# EAGLE design PiHAT_v0.3 (EAGLE 7.7.0)
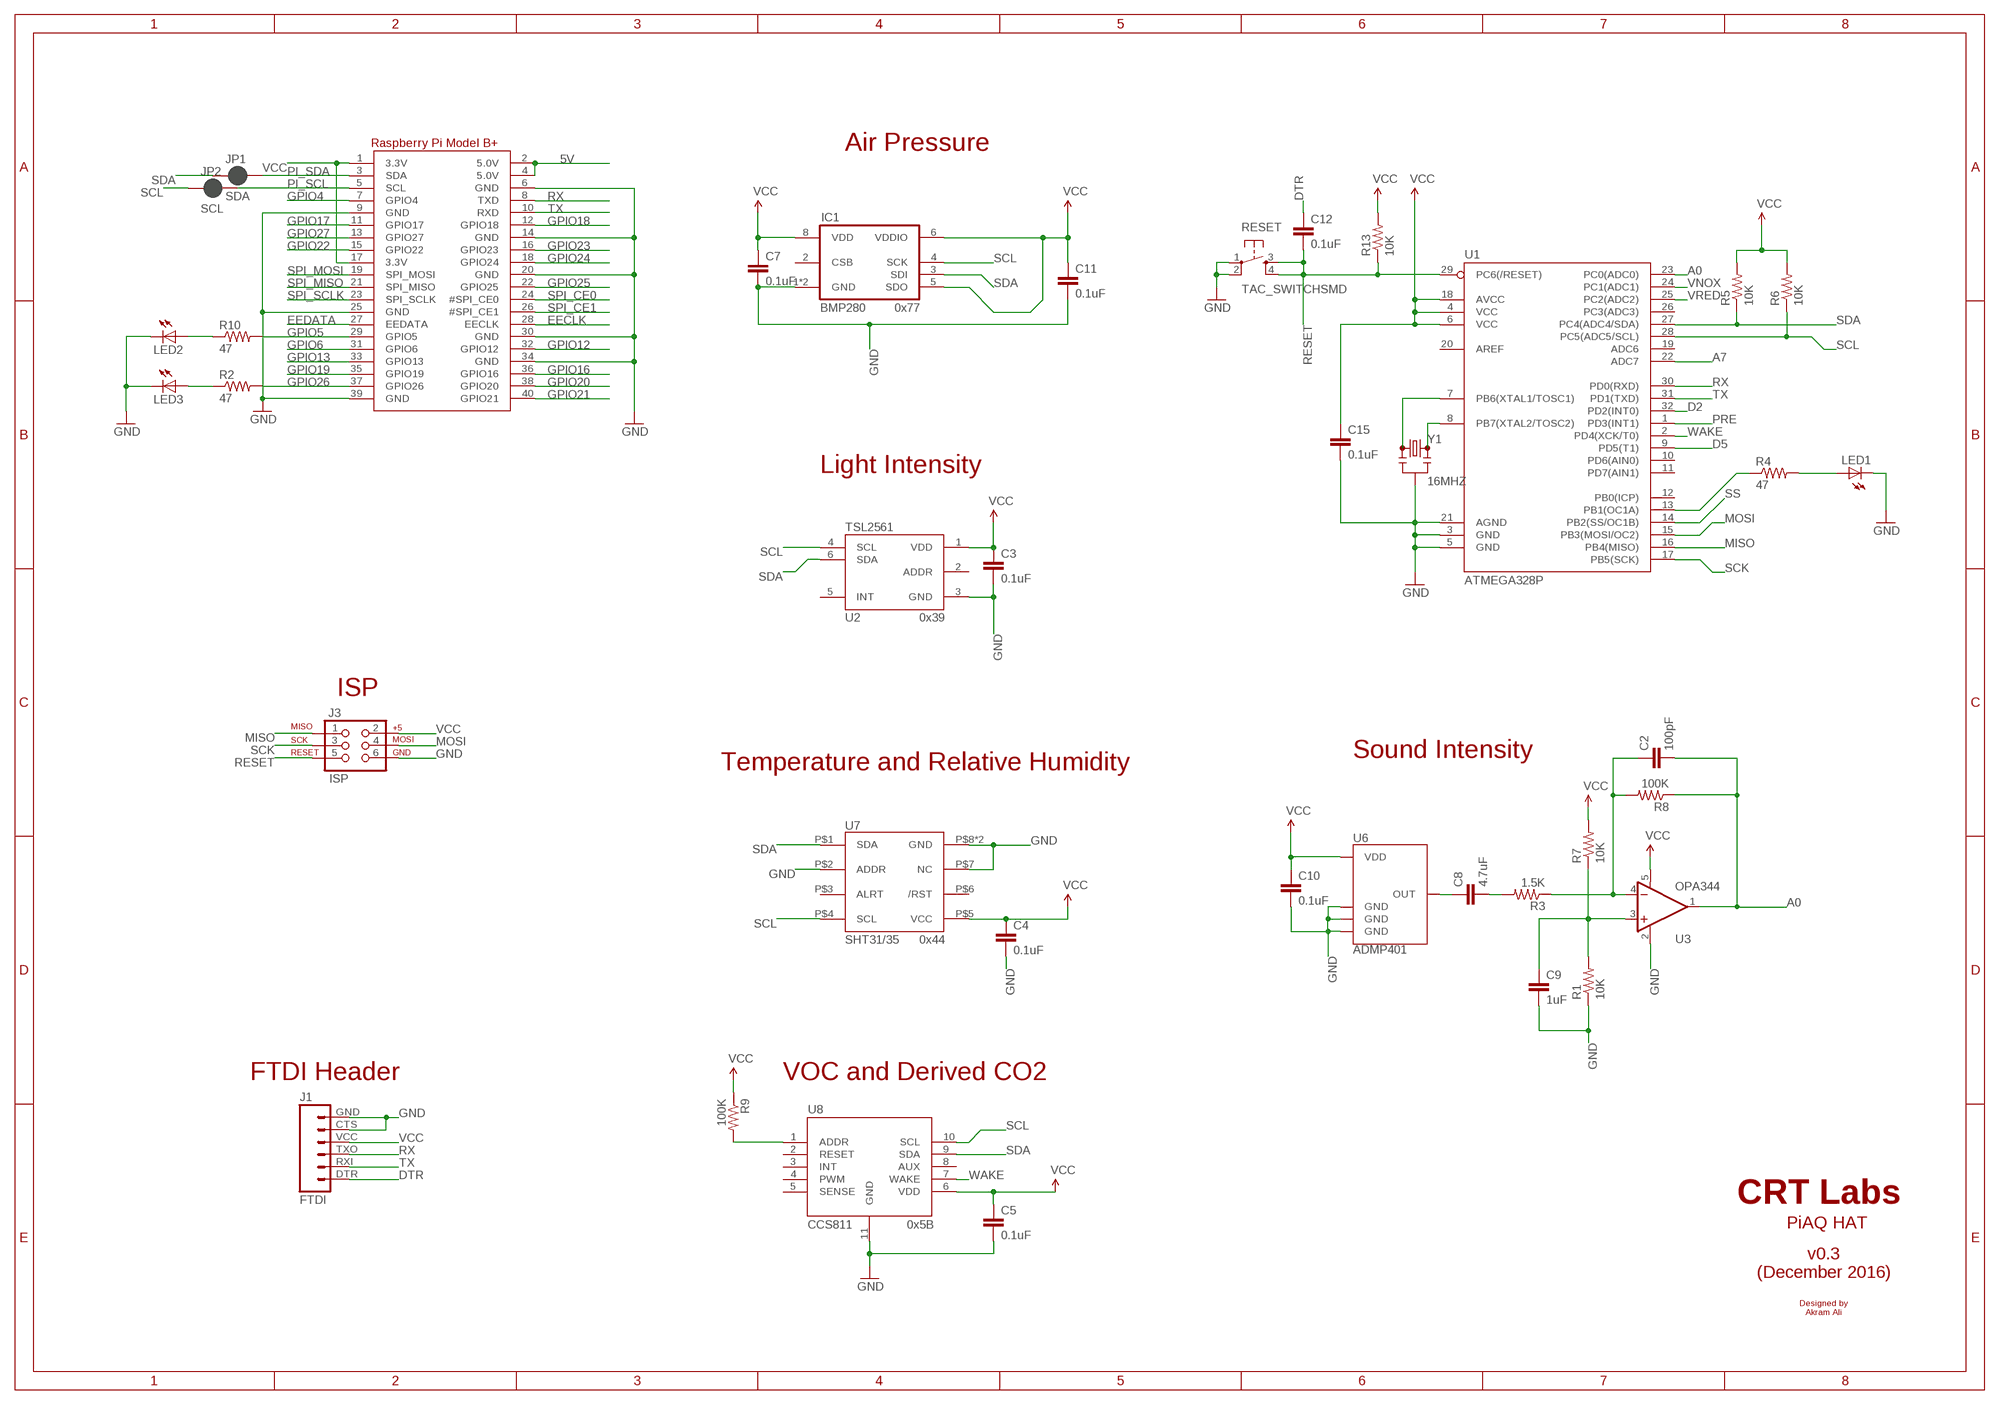
[diagram p0: schematic, sheet 1]

## Parts
C2  100pF  CAP0805  [0805]
C3  0.1uF  CAP0805  [0805]
C4  0.1uF  CAP0805  [0805]
C5  0.1uF  CAP0805  [0805]
C7  0.1uF  CAP0805  [0805]
C8  4.7uF  CAP0805  [0805]
C9  1uF  CAP0805  [0805]
C10  0.1uF  CAP0805  [0805]
C11  0.1uF  CAP0805  [0805]
C12  0.1uF  CAP0805  [0805]
C15  0.1uF  CAP0805  [0805]
IC1  BMP280  [BMP280]
J1  FTDI  FTDI_BASICPTH  [FTDI_BASIC]
J3  ISP  AVR_SPI_PRG_6PTH  [2X3]
JP1  SDA  JUMPER-PAD-2-NC_BY_PASTEFULL-BOX-SILK  [PAD-JUMPER-2-NC_BY_PASTE_YES_SILK_FULL_BOX]
JP2  SCL  JUMPER-PAD-2-NC_BY_PASTEFULL-BOX-SILK  [PAD-JUMPER-2-NC_BY_PASTE_YES_SILK_FULL_BOX]
LED1  LEDCHIPLED_0805  [CHIPLED_0805]
LED2  LEDCHIPLED_0805  [CHIPLED_0805]
LED3  LEDCHIPLED_0805  [CHIPLED_0805]
R1  10K  RESISTOR0805-RES  [0805]
R2  47  RESISTOR0805-RES  [0805]
R3  1.5K  RESISTOR0805-RES  [0805]
R4  47  RESISTOR0805-RES  [0805]
R5  10K  RESISTOR0805-RES  [0805]
R6  10K  RESISTOR0805-RES  [0805]
R7  10K  RESISTOR0805-RES  [0805]
R8  100K  RESISTOR0805-RES  [0805]
R9  100K  RESISTOR0805-RES  [0805]
R10  47  RESISTOR0805-RES  [0805]
R13  10K  RESISTOR0805-RES  [0805]
RESET  TAC_SWITCHSMD  [TACTILE-SWITCH-SMD]
RPI1  RASPBERRYPI_BPLUS_HATSLOTS  [PI_HAT_SLOTS]
U1  ATMEGA328P  ATMEGA328P_TQFP  [TQFP32-08]
U2  TSL2561  TSL2561FN  [FN-6]
U3  OPA344  [SOT23-5]
U6  ADMP401  [ADMP401]
U7  SHT31/35  SHT31-DIS  [SHT3X]
U8  CCS811  CCS811-I2C  [LGA]
Y1  16MHZ  RESONATOR16MHZ  [RESONATOR-SMD]

## Nets
5V: RPI1.2(5.0V) RPI1.4(5.0V)
A0: C2.2 R8.1 U1.23(PC0(ADC0)) U3.1(OUT)
A7: U1.22(ADC7)
D2: U1.32(PD2(INT0))
D5: U1.9(PD5(T1))
DTR: C12.1 J1.DTR
EECLK: RPI1.28(EECLK)
EEDATA: RPI1.27(EEDATA)
GND: C3.2 C4.2 C5.2 C7.2 C9.2 C10.2 C11.2 C15.2 IC1.1(GND) IC1.7(GND) J1.CTS J1.GND J3.6 LED1.C LED2.C LED3.C R1.1 RESET.1 RESET.2 RPI1.6(GND) RPI1.9(GND) RPI1.14(GND) RPI1.20(GND) RPI1.25(GND) RPI1.30(GND) RPI1.34(GND) RPI1.39(GND) U1.3(GND) U1.5(GND) U1.21(AGND) U2.3(GND) U3.2(V-) U6.2(GND) U6.4(GND) U6.6(GND) U7.P$2(ADDR) U7.P$7(NC) U7.P$8(GND) U7.PAD(GND) U8.11(GND) Y1.2
GPIO4: RPI1.7(GPIO4)
GPIO5: R10.2 RPI1.29(GPIO5)
GPIO6: RPI1.31(GPIO6)
GPIO12: RPI1.32(GPIO12)
GPIO13: RPI1.33(GPIO13)
GPIO16: RPI1.36(GPIO16)
GPIO17: RPI1.11(GPIO17)
GPIO18: RPI1.12(GPIO18)
GPIO19: RPI1.35(GPIO19)
GPIO20: RPI1.38(GPIO20)
GPIO21: RPI1.40(GPIO21)
GPIO22: RPI1.15(GPIO22)
GPIO23: RPI1.16(GPIO23)
GPIO24: RPI1.18(GPIO24)
GPIO25: RPI1.22(GPIO25)
GPIO26: R2.2 RPI1.37(GPIO26)
GPIO27: RPI1.13(GPIO27)
MISO: J3.1 U1.16(PB4(MISO))
MOSI: J3.4 U1.15(PB3(MOSI/OC2))
N$1: LED3.A R2.1
N$2: R4.1 U1.13(PB1(OC1A))
N$3: LED1.A R4.2
N$4: U1.8(PB7(XTAL2/TOSC2)) Y1.3
N$5: U1.7(PB6(XTAL1/TOSC1)) Y1.1
N$6: LED2.A R10.1
N$7: C8.1 U6.1(OUT)
N$9: C8.2 R3.2
N$10: C2.1 R3.1 R8.2 U3.4(-IN)
N$11: C9.1 R1.2 R7.1 U3.3(+IN)
N$16: R9.2 U8.1(ADDR)
PI_SCL: JP2.2 RPI1.5(SCL)
PI_SDA: JP1.2 RPI1.3(SDA)
PRE: U1.1(PD3(INT1))
RESET: C12.2 J3.5 R13.1 RESET.3 RESET.4 U1.29(PC6(/RESET))
RX: J1.TXO RPI1.8(TXD) U1.30(PD0(RXD))
SCK: J3.3 U1.17(PB5(SCK))
SCL: IC1.4(SCK) JP2.1 R6.1 U1.28(PC5(ADC5/SCL)) U2.4(SCL) U7.P$4(SCL) U8.10(SCL)
SDA: IC1.3(SDI) JP1.1 R5.1 U1.27(PC4(ADC4/SDA)) U2.6(SDA) U7.P$1(SDA) U8.9(SDA)
SPI_CE0: RPI1.24(#SPI_CE0)
SPI_CE1: RPI1.26(#SPI_CE1)
SPI_MISO: RPI1.21(SPI_MISO)
SPI_MOSI: RPI1.19(SPI_MOSI)
SPI_SCLK: RPI1.23(SPI_SCLK)
SS: U1.14(PB2(SS/OC1B))
TX: J1.RXI RPI1.10(RXD) U1.31(PD1(TXD))
VCC: C3.1 C4.1 C5.1 C7.1 C10.1 C11.1 C15.1 IC1.5(SDO) IC1.6(VDDIO) IC1.8(VDD) J1.VCC J3.2 R5.2 R6.2 R7.2 R9.1 R13.2 RPI1.1(3.3V) RPI1.17(3.3V) U1.4(VCC) U1.6(VCC) U1.18(AVCC) U2.1(VDD) U3.5(V+) U6.5(VDD) U7.P$5(VCC) U8.6(VDD)
VNOX: U1.24(PC1(ADC1))
VRED: U1.25(PC2(ADC2))
WAKE: U1.2(PD4(XCK/T0)) U8.7(WAKE)
Unconnected: IC1.2(CSB) U1.10(PD6(AIN0)) U1.11(PD7(AIN1)) U1.12(PB0(ICP)) U1.19(ADC6) U1.20(AREF) U1.26(PC3(ADC3)) U2.2(ADDR) U2.5(INT) U7.P$3(ALRT) U7.P$6(/RST) U8.2(RESET) U8.3(INT) U8.4(PWM) U8.5(SENSE) U8.8(AUX)

## Notes on the sheet
- Air Pressure
- 0x77
- Light Intensity
- 0x39
- ISP
- Sound Intensity
- Temperature and Relative Humidity
- 0x44
- FTDI Header | VOC and Derived CO2
- CRT Labs
- 0x5B | PiAQ HAT
- v0.3
  (December 2016)
- Designed by
  Akram Ali

## Library data of the parts
C2 = SparkFun-Capacitors:CAP: Capacitor Standard 0603 ceramic capacitor, and 0.1" leaded capacitor.; MPN: CC0805JRNPO9BN101
C3-C5 C7 C11 C12 C15 = SparkFun-Passives:CAP: Capacitor Standard 0603 ceramic capacitor, and 0.1" leaded capacitor.; MPN: CC0603KRX7R7BB104
C8 = SparkFun-Capacitors:CAP: Capacitor Standard 0603 ceramic capacitor, and 0.1" leaded capacitor.; MPN: CC0805KKX5R8BB475
C9 = SparkFun-Capacitors:CAP: Capacitor Standard 0603 ceramic capacitor, and 0.1" leaded capacitor.; MPN: CC0805KKX7R7BB105
C10 = SparkFun-Capacitors:CAP: Capacitor Standard 0603 ceramic capacitor, and 0.1" leaded capacitor.; MPN: CC0603KRX7R7BB104
IC1 = bosch-bmp280:BMP280: The BMP280 is an absolute barometric pressure sensor especially designed for mobile applications. The sensor module is housed in an extremely compact 8-pin metal-lid LGA package with a footprint of only 2.0 × 2.5 mm2 and 0.95 mm package height. Its small dimensions and its low power consumption of 2.7 μA @1Hz allow the implementation in battery driven devices such as mobile phones, GPS modules or watches. The library has been designed by Richard Magdycz <https://www.facebook.com/groups/eaglecadsoftUK>; MPN: BMP280
J1 = SparkFun-Connectors:FTDI_BASIC: FTDI Basic header with labels; NO_BOM: TRUE
J3 = SparkFun-Connectors:AVR_SPI_PRG_6: AVR ISP 6 Pin This is the reduced ISP connector for AVR programming. Common on Arduino. This footprint will take up less PCB space and can be used with a 10-pin to 6-pin adapter such as SKU: BOB-08508 **Special note about "TEST_POINT" package. The stop mask is on the top side, so if you want your programming test points to be on the bottom of your board, make sure to place this package on the bottom side of the board. This also ensure that the orientation to program from the bottom side will be correct.; NO_BOM: TRUE
JP1 JP2 = SparkFun-Passives:JUMPER-PAD-2-NC_BY_PASTE; NO_BOM: TRUE
LED1-LED3 = adafruit:LED: LED OSRAM: - CHIPLED LG R971, LG N971, LY N971, LG Q971, LY Q971, LO R971, LY R971 LH N974, LH R974 LS Q976, LO Q976, LY Q976 LO Q996 - Hyper CHIPLED LW Q18S LB Q993, LB Q99A, LB R99A - SideLED LS A670, LO A670, LY A670, LG A670, LP A670 LB A673, LV A673, LT A673, LW A673 LH A674 LY A675 LS A676, LA A676, LO A676, LY A676, LW A676 LS A679, LY A679, LG A679 - Hyper Micro SIDELED® LS Y876, LA Y876, LO Y876, LY Y876 LT Y87S - SmartLED LW L88C, LW L88S LB L89C, LB L89S, LG L890 LS L89K, LO L89K, LY L89K LS L896, LA L896, LO L896, LY L896 - TOPLED LS T670, LO T670, LY T670, LG T670, LP T670 LSG T670, LSP T670, LSY T670, LOP T670, LYG T670 LG T671, LOG T671, LSG T671 LB T673, LV T673, LT T673, LW T673 LH T674 LS T676, LA T676, LO T676, LY T676, LB T676, LH T676, LSB T676, LW T676 LB T67C, LV T67C, LT T67C, LS T67K, LO T67K, LY T67K, LW E67C LS E67B, LA E67B, LO E67B, LY E67B, LB E67C, LV E67C, LT E67C LW T67C LS T679, LY T679, LG T679 LS T770, LO T770, LY T770, LG T770, LP T770 LB T773, LV T773, LT T773, LW T773 LH T774 LS E675, LA E675, LY E675, LS T675 LS T776, LA T776, LO T776, LY T776, LB T776 LHGB T686 LT T68C, LB T68C - Hyper Mini TOPLED® LB M676 - Mini TOPLED Santana® LG M470 LS M47K, LO M47K, LY M47K Source: http://www.osram.convergy.de/; MPN: LTST-C170TBKT
R1 R7 R13 = SparkFun-Passives:RESISTOR: Resistor Basic schematic elements and footprints for 0603, 1206, and PTH resistors.; MPN: RC0805JR-0710KL
R2 R4 R10 = SparkFun-Resistors:RESISTOR: Resistor Basic schematic elements and footprints for 0603, 1206, and PTH resistors.; MPN: RC0805JR-0747RL
R3 = SparkFun-Passives:RESISTOR: Resistor Basic schematic elements and footprints for 0603, 1206, and PTH resistors.; MPN: RT0805BRD071K5L
R5 R6 = SparkFun-Resistors:RESISTOR: Resistor Basic schematic elements and footprints for 0603, 1206, and PTH resistors.; MPN: RC0805JR-0710KL
R8 R9 = SparkFun-Passives:RESISTOR: Resistor Basic schematic elements and footprints for 0603, 1206, and PTH resistors.; MPN: RC0805FR-07100KL
RESET = SparkFun-Retired:TAC_SWITCH: Momentary Switch Button commonly used for reset or general input. Spark Fun Electronics SKU : COM-00097 SMT- SWCH-08247; MPN: PTS525SM15SMTR2 LFS; PROD_ID: SWCH-08247
RPI1 = microbuilder:RASPBERRYPI_BPLUS; NO_BOM: TRUE
U1 = SparkFun-DigitalIC:ATMEGA328P_TQFP; MPN: ATMEGA328PB-AU; PROD_ID: IC-09069; VALUE: ATMEGA328P_TQFP
U2 = SparkFun-DigitalIC:TSL2561: TSL2561 illumination sensor Approximates Human Eye Response Precisely Measures Illuminance Programmable Interrupt Function with User-Defined Upper and Lower Threshold 400 KHz I2C interface Programmable Analog Gain and Integration Time Supporting 1,000,000-to-1 Dynamic Range Automatically Rejects 50/60-Hz Lighting Ripple Low Active Power (0.75 mW Typical) with Power Down Mode RoHS Compliant The TSL2561 is a light-to-digital converter that transform light intensity to a digital signal output via I2C interface. The device combines one broadband photodiode (visible plus infrared) and one infrared-responding photodiode on a single CMOS integrated circuit capable of providing a near-photopic response over an effective 20-bit dynamic range (16-bit resolution). Two integrating ADCs convert the photodiode currents to a digital output that represents the irradiance measured on each channel. This digital output can be input to a microprocessor where illuminance (ambient light level) in lux is derived using an empirical formula to approximate the human eye response. The TSL2561 device supports a traditional level style interrupt that remains asserted until the firmware clears it.; MPN: TSL2561FN; PROD_ID: IC-11791
U3 = SparkFun-AnalogIC:OPA344: Single gate rail-to-rail output op-amp. Inputs extend 300mV past rails.; MPN: OPA344NA/3K; PROD_ID: IC-08251
U6 = SparkFun-Sensors:ADMP401: Omnidirection bottom-port MEMS microphone; MPN: INMP401ACEZ-R7
U7 = thomasb9511:SHT31-DIS; MPN: SHT31-DIS-B
U8 = CCS811:CCS811; MPN: CCS811
Y1 = SparkFun-FreqCtrl:RESONATOR: Resonator Small SMD resonator. Used, eg, on the Arduino Pro/ Pro Mini boards. 8MHz- XTAL-08895 16MHz- XTAL-08900; MPN: CSTCE16M0V53-R0; PROD_ID: XTAL-08900

## Board
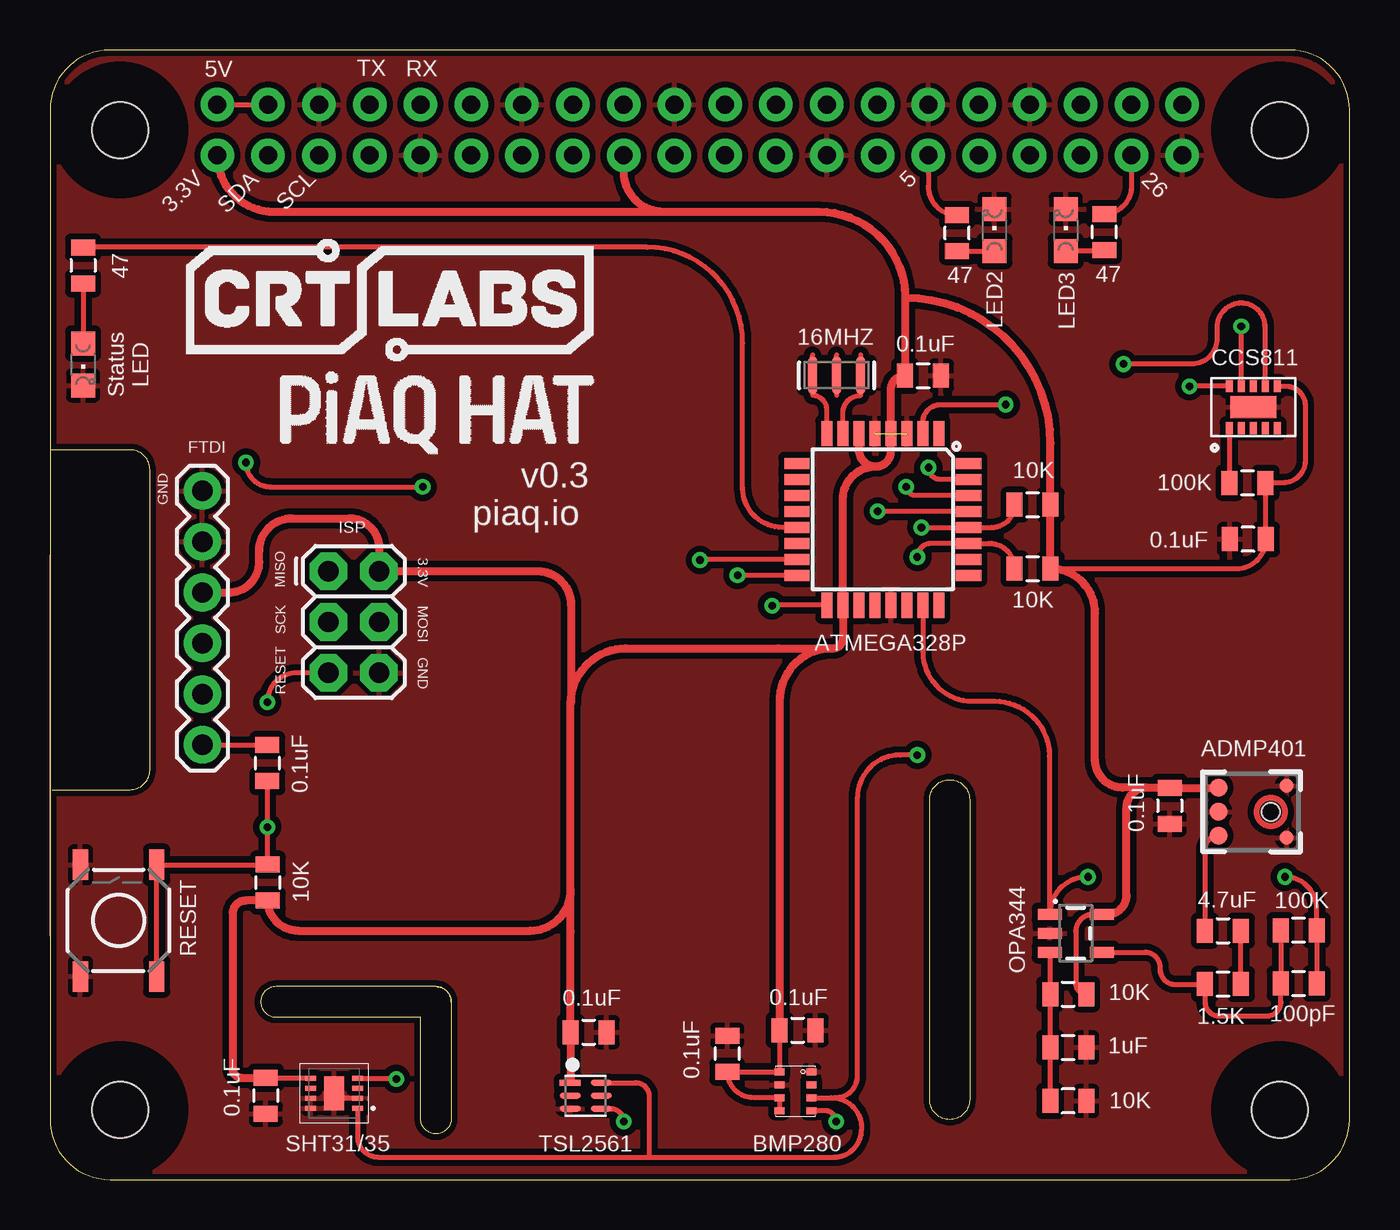
[diagram p1: board, top side]
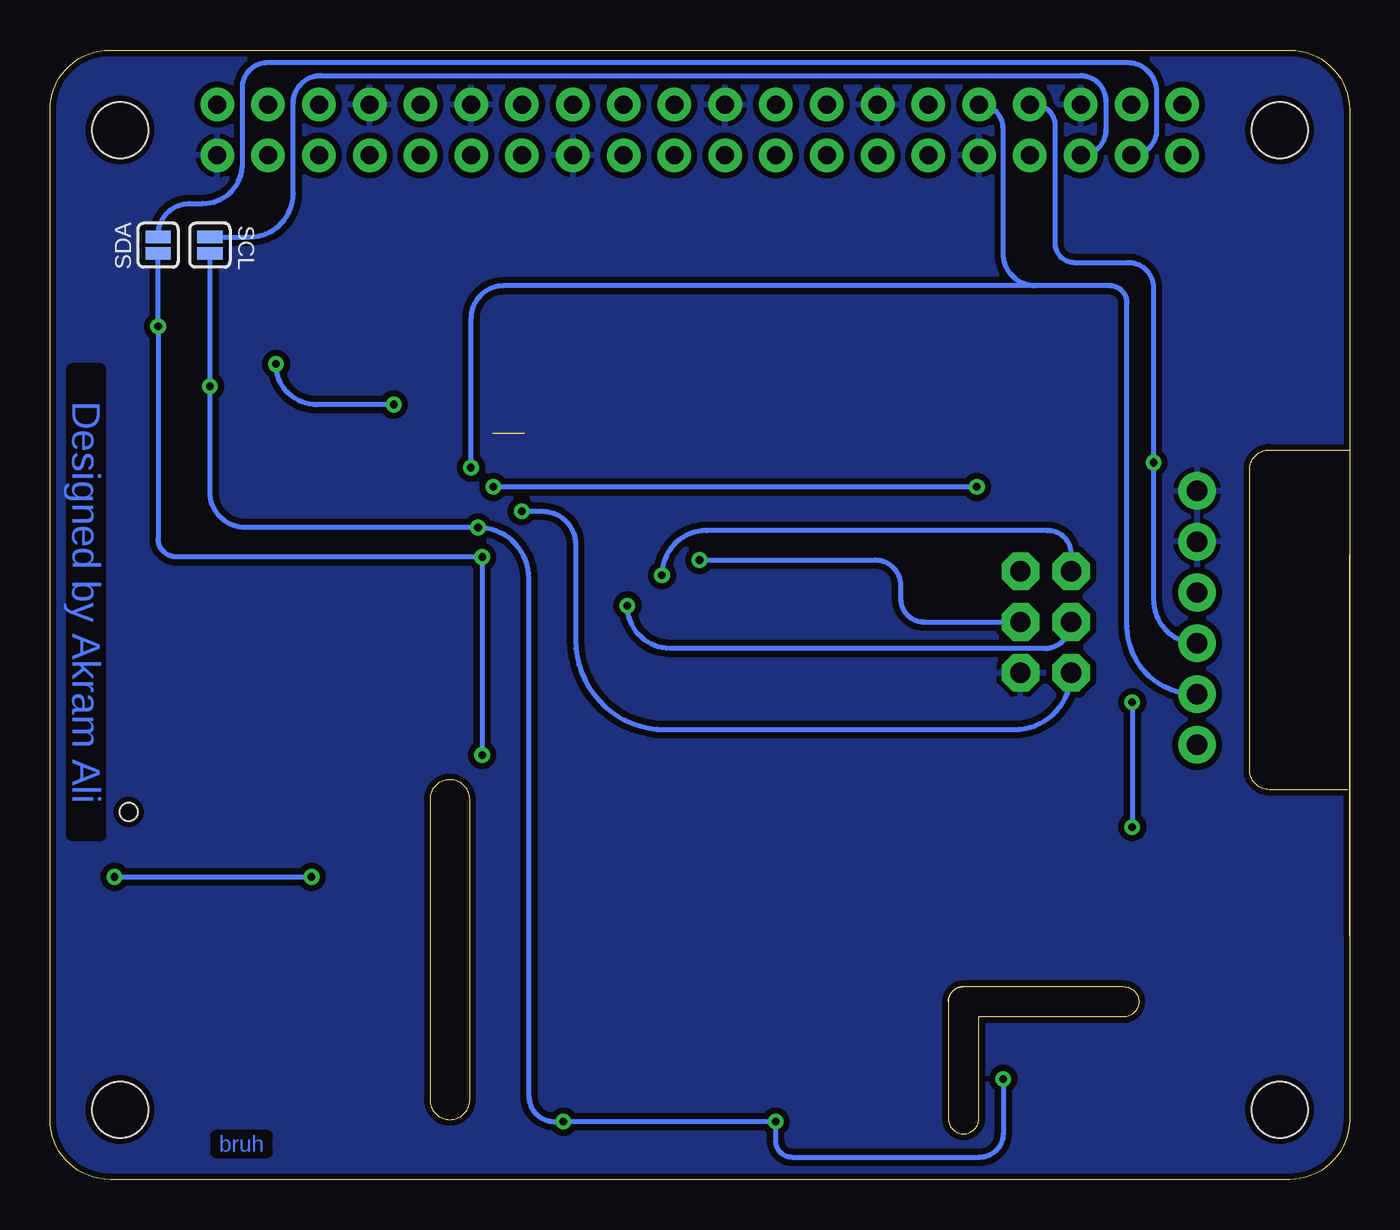
[diagram p2: board, bottom side, seen from below]

Size 65 x 56.5 mm. Coordinates in mm from the lower left corner, seen from the top.
Outline: 0,19.56 0,19.68
Outline: 0,12.19 0,31.24
Outline: 20.07,8.89 arc90 19.3,9.65
Outline: 19.3,9.65 11.3,9.65 arc90 10.54,8.89 arc90 11.3,8.13 18.54,8.13 18.54,3.05 arc90 19.3,2.29 arc90 20.07,3.05 20.07,8.89
Outline: 19.3,9.65 arc-90 20.07,8.89
Copper layers (1*16): Top 0.035mm / dielectric 1.5mm / Bottom 0.035mm
Design rules "adafruit *": minimum track width 7mil, minimum drill 15.5mil, track to track 7mil, track to pad 7mil, pad to pad 7mil, via to via 8mil, smd to smd 8mil, copper to edge 10mil, drill to drill 8mil, minimum pad ring 10mil, minimum via ring 8mil, stop-mask expansion 2mil, vias tented up to drill 20mil, thermal gap 10mil

### Footprints (pad centres in the part's own frame; a part is rotated, then mirrored left to right if it is on the bottom)
0805 = smd 0.8 x 1.2: 1 -0.9,0; 2 0.9,0
BMP280 = smd 0.35 x 0.5: 1 0.975,-0.8; 2 0.325,-0.8; 3 -0.325,-0.8; 4 -0.975,-0.8; 5 -0.975,0.8; 6 -0.325,0.8; 7 0.325,0.8; 8 0.975,0.8
FTDI_BASIC = drill 1.016 pad 1.88: CTS 10.16,0; DTR 0,0; GND 12.7,0; RXI 2.54,0; TXO 5.08,0; VCC 7.62,0
2X3 = drill 1.016 pad 1.88 octagon: 1 0,0; 2 0,2.54; 3 2.54,0; 4 2.54,2.54; 5 5.08,0; 6 5.08,2.54
PAD-JUMPER-2-NC_BY_PASTE_YES_SILK_FULL_BOX = smd 0.635 x 1.27: 1 -0.412,0; 2 0.412,0
CHIPLED_0805 = smd 1.2 x 1.2: A 0,-1.05; C 0,1.05
TACTILE-SWITCH-SMD = smd 1.524 x 0.762: 1 -2.794,1.905; 2 2.794,1.905; 3 -2.794,-1.905; 4 2.794,-1.905
PI_HAT_SLOTS = drill 0.9 pad 1.676: 1 8.37,51.23; 2 8.37,53.77; 3 10.91,51.23; 4 10.91,53.77; 5 13.45,51.23; 6 13.45,53.77; 7 15.99,51.23; 8 15.99,53.77; 9 18.53,51.23; 10 18.53,53.77; 11 21.07,51.23; 12 21.07,53.77; 13 23.61,51.23; 14 23.61,53.77; 15 26.15,51.23; 16 26.15,53.77; 17 28.69,51.23; 18 28.69,53.77; 19 31.23,51.23; 20 31.23,53.77; 21 33.77,51.23; 22 33.77,53.77; 23 36.31,51.23; 24 36.31,53.77; 25 38.85,51.23; 26 38.85,53.77; 27 41.39,51.23; 28 41.39,53.77; 29 43.93,51.23; 30 43.93,53.77; 31 46.47,51.23; 32 46.47,53.77; 33 49.01,51.23; 34 49.01,53.77; 35 51.55,51.23; 36 51.55,53.77; 37 54.09,51.23; 38 54.09,53.77; 39 56.63,51.23; 40 56.63,53.77 | hole 2.8: 3.5,3.5; 3.5,52.5; 61.5,52.5; 61.5,3.5
TQFP32-08 = smd 1.27 x 0.559: 1 -4.293,2.8; 2 -4.293,2; 3 -4.293,1.2; 4 -4.293,0.4; 5 -4.293,-0.4; 6 -4.293,-1.2; 7 -4.293,-2; 8 -4.293,-2.8; 17 4.293,-2.8; 18 4.293,-2; 19 4.293,-1.2; 20 4.293,-0.4; 21 4.293,0.4; 22 4.293,1.2; 23 4.293,2; 24 4.293,2.8 | smd 0.559 x 1.27: 9 -2.8,-4.293; 10 -2,-4.293; 11 -1.2,-4.293; 12 -0.4,-4.293; 13 0.4,-4.293; 14 1.2,-4.293; 15 2,-4.293; 16 2.8,-4.293; 25 2.8,4.293; 26 2,4.293; 27 1.2,4.293; 28 0.4,4.293; 29 -0.4,4.293; 30 -1.2,4.293; 31 -2,4.293; 32 -2.8,4.293
FN-6 = smd 1.05 x 0.3: 1 -0.775,0.65; 2 -0.775,0; 3 -0.775,-0.65; 4 0.775,-0.65; 5 0.775,0; 6 0.775,0.65
SOT23-5 = smd 0.55 x 1.2: 1 -0.95,-1.3; 2 0,-1.3; 3 0.95,-1.3; 4 0.95,1.3; 5 -0.95,1.3
ADMP401 = smd 0.9 x 0.9: 1 -1.2,2.62; 5 1.2,2.62; 6 0,2.62 | smd 0.7 x 0.7: 2 1.3,-0.8; 4 -1.3,-0.8 | hole 0.9: 0,0
SHT3X = smd 0.55 x 0.25: P$1 -1.175,0.75; P$2 -1.175,0.25; P$3 -1.175,-0.25; P$4 -1.175,-0.75; P$5 1.175,-0.75; P$6 1.175,-0.25; P$7 1.175,0.25; P$8 1.175,0.75 | smd 1 x 1.7: PAD 0,0
LGA = smd 0.6 x 0.35: 1 0.3,3.2; 2 0.3,2.6; 3 0.3,2; 4 0.3,1.4; 5 0.3,0.8; 6 2.4,0.8; 7 2.4,1.4; 8 2.4,2; 9 2.4,2.6; 10 2.4,3.2 | smd 1.1 x 2.3: 11 1.35,2
RESONATOR-SMD = smd 0.45 x 1.905: 1 -1.2,0; 2 0,0; 3 1.2,0

### Placement (x,y rotation side)
C2  62.46,9.8 0 top
C3  26.95,7.37 0 top
C4  10.79,4.19 270 top
C5  59.92,32.03 180 top
C7  37.39,7.47 0 top
C8  58.67,12.45 0 top
C9  50.93,6.6 0 top
C10  56.01,18.69 270 top
C11  33.88,6.3 90 top
C12  10.87,20.83 270 top
C15  43.66,40.21 0 top
IC1  37.29,4.42 90 top
J1  7.62,21.74 90 top
J3  13.92,30.43 270 top
JP1  59.59,46.74 90 bottom
JP2  57,46.74 90 bottom
LED1  1.65,40.77 180 top
LED2  47.24,47.5 0 top
LED3  50.8,47.5 0 top
R1  50.93,3.94 180 top
R2  52.73,47.4 90 top
R3  58.67,9.78 0 top
R4  1.65,45.72 270 top
R5  49.15,30.56 0 top
R6  49.15,33.76 0 top
R7  50.93,9.27 0 top
R8  62.46,12.47 180 top
R9  59.89,34.85 180 top
R10  45.36,47.35 90 top
R13  10.9,14.86 270 top
RESET  3.43,12.95 90 top
RPI1  0,0 0 top
U1  41.66,33.02 270 top
U2  26.8,4.19 0 top
U3  51.31,12.32 270 top
U6  61.06,18.39 90 top
U7  14.22,4.32 180 top
U8  62.18,37.29 90 top
Y1  39.34,40.23 180 top

### Tracks (layer width: path | path; a pad name or v marks a point on that pad's centre or on a via)
5V
  Top 0.254: RPI1.2 RPI1.4
A0  (via drill 0.38 pad 0.25)
  Top 0.254: U1.23 43.66,26.4 arc90 46.13,23.93 47.24,23.93 arc-90 49.99,21.18 49.99,13.29 arc90 U3.1 arc-90 51.88,15.14 v51.92,15.14 | C2.2 R8.1 63.36,13.55 arc90 v61.77,15.14
  Bottom 0.254: v61.77,15.14 v51.92,15.14
DTR
  Top 0.254: J1.DTR 10.86,21.74 arc-90 C12.1
GND  (1 unrouted)
  Top 0.254: U7.P$2 14.47,4.07 U7.PAD
  pour Top (isolate 0.305): -0.76,56.9 65.53,56.9 65.53,-0.51 -0.89,-0.51 -0.89,56.9
  pour Bottom (isolate 0.305): 0.08,57.05 65.53,57.05 65.53,-0.23 -0.38,-0.23 -0.38,57.05
GPIO5
  Top 0.254: RPI1.29 43.93,49.68 arc90 R10.2
GPIO26
  Top 0.254: RPI1.37 54.09,49.66 arc-90 R2.2
MISO  (via drill 0.38 pad 0.25)
  Top 0.254: v34.39,30.23 U1.16 arc-90 U1.16
  Bottom 0.254: J3.1 13.92,31.29 arc-90 15.09,32.46 32.16,32.46 arc-90 v34.39,30.23
MOSI  (via drill 0.38 pad 0.25)
  Top 0.254: U1.15 32.54,31.02 arc90 v32.51,30.99
  Bottom 0.254: v32.51,30.99 23.72,30.99 arc90 22.45,29.72 22.45,29.06 arc-90 21.29,27.89 J3.4
N$1
  Top 0.254: R2.1 arc-90 52.68,46.45 LED3.A
N$2
  Top 0.254: U1.13 36.62,32.62 arc-90 34.65,34.6 34.65,41.86 arc90 29.87,46.63 1.67,46.63 arc90 R4.1
N$3
  Top 0.254: R4.2 LED1.A
N$4
  Top 0.254: U1.8 38.86,38.51 arc90 38.15,39.22
N$5
  Top 0.254: U1.7 39.66,38.33 arc-90 40.55,39.22
N$6
  Top 0.254: R10.1 arc-90 R10.1 LED2.A
N$7
  Top 0.254: U6.1 arc90 57.76,16.51 C8.1
N$9
  Top 0.254: R3.2 C8.2
N$10
  Top 0.254: U3.4 54.77,11.37 arc-90 55.52,10.62 55.52,10.52 arc90 56.29,9.75 57.75,9.75 arc90 R3.1 57.77,8.88 arc90 58.47,8.18 60.86,8.18 arc90 61.57,8.89 C2.1 arc90 C2.1 R8.2
N$11
  Top 0.254: R1.2 C9.1 R7.1 arc-90 50.01,9.29 U3.3
N$16
  Top 0.254: U8.1 58.98,34.86 arc90 R9.2
PI_SCL
  Bottom 0.254: JP2.2 55.01,47.15 arc-90 52.83,49.33 52.83,53.85 arc90 51.46,55.22 13.46,55.22 arc90 12.19,53.95 12.19,52.49 arc90 RPI1.5
PI_SDA
  Bottom 0.254: JP1.2 59.59,47.24 arc90 58.01,48.82 57.35,48.82 arc-90 55.37,50.8 55.37,54.61 arc90 54.1,55.88 11.12,55.88 arc90 9.65,54.41 9.65,52.49 arc90 RPI1.3
RESET  (via drill 0.38 pad 0.25)
  Top 0.254: RESET.3 RESET.4 10.89,15.75 R13.1 arc-90 10.87,15.78 v10.87,17.63 C12.2 | J3.5 12.34,25.35 arc90 v10.87,23.88 | U1.29 v41.41,33.42 arc-90 v41.4,33.43
  Bottom 0.254: v10.87,23.88 v10.87,17.63 | v41.4,33.43 40.39,33.43 arc90 38.71,31.75 38.71,26.97 arc-90 34.24,22.5 16.76,22.5 arc-90 J3.5
RX  (via drill 0.38 pad 0.25)
  Top 0.254: U1.30 43.35,34.22 arc-90 v42.82,34.65 | v9.8,35.87 arc90 11.02,34.65 v18.64,34.65
  Bottom 0.254: RPI1.8 15.77,53.77 arc90 14.73,52.73 14.73,46.84 arc-90 13.77,45.87 11.07,45.87 arc90 9.8,44.6 v9.8,35.87 9.8,29.01 arc-90 J1.TXO | v18.64,34.65 v42.82,34.65
SCK  (via drill 0.38 pad 0.25)
  Top 0.254: U1.17 36.14,28.73 arc90 v36.12,28.7
  Bottom 0.254: J3.3 arc90 15.24,26.57 33.98,26.57 arc90 v36.12,28.7
SCL  (via drill 0.38 pad 0.25)
  Top 0.254: U2.4 28.06,3.54 arc-90 v28.7,2.9 | U7.P$4 17.28,5.07 v17.32,5.03 | IC1.4 38.1,3.45 38.76,3.45 arc-90 v39.32,2.9 | R6.1 arc-90 47.11,32.62 U1.28 arc-90 U1.28 v43.59,32.61 | U8.10 57.01,39.69 arc90 v57,39.68
  Bottom 0.254: v17.32,5.03 17.32,2.29 arc90 18.49,1.12 27.89,1.12 arc90 28.7,1.93 v28.7,2.9 v39.32,2.9 39.78,2.9 arc90 41.05,4.17 41.05,30.07 arc-90 v43.59,32.61 55.22,32.61 arc90 57,34.39 v57,39.68 JP2.1
SDA  (via drill 0.38 pad 0.25)
  Top 0.254: U7.P$1 15.4,2.13 arc90 16.41,1.12 30.02,1.12 | 30.02,1.12 39.22,1.12 arc90 40.59,2.49 40.59,2.59 arc90 39.09,4.1 | U2.6 29.3,4.84 arc-90 29.97,4.17 29.97,1.17 30.02,1.12 | IC1.3 39.09,4.1 | 39.09,4.1 39.3,4.1 arc90 40.39,5.18 40.39,19.1 arc-90 42.52,21.23 v43.38,21.23 | R5.1 arc-90 48.26,30.54 arc90 R5.1 | R5.1 arc90 46.98,31.82 U1.27 44.06,31.82 arc90 v43.38,31.14 | U8.9 v59.58,42.66 arc-90 v59.59,42.67
  Bottom 0.254: v43.38,21.23 v43.38,31.14 58.67,31.14 arc90 59.59,32.05 v59.59,42.67 JP1.1
TX  (via drill 0.38 pad 0.25)
  Top 0.254: U1.31 44.53,35.02 arc-90 v43.94,35.61
  Bottom 0.254: J1.RXI 7.72,24.28 arc90 11.12,27.69 11.12,43.84 arc-90 11.99,44.7 15.7,44.7 | 15.7,44.7 arc90 17.32,46.33 17.32,52.56 arc-90 RPI1.10 | v43.94,35.61 43.94,43.08 arc90 42.32,44.7 15.7,44.7
VCC
  Top 0.254: C4.1 10.82,5.07 U7.P$5 | 26.05,4.87 U2.1 | 36.49,26.5 36.42,26.57 | IC1.5 IC1.6 35.19,4.1 arc-90 C11.1 arc90 C11.1 IC1.8 arc90 IC1.8 C7.1 | 26,12.45 arc-90 26.05,12.39 | 26.06,23.82 arc-90 26.05,23.81 | 52.89,13.27 U3.5 52.18,13.27 arc90 51.31,12.39 51.31,9.79 arc90 R7.2 | 55.99,19.61 arc-90 C10.1 | U6.5 arc-90 U6.5 | U8.6 61.81,39.69 arc-90 62.79,38.71 62.79,35.97 arc-90 61.67,34.85 R9.1 arc-90 60.82,34.82 C5.1 arc-90 59.34,30.56 R5.2
  Top 0.406: C4.1 9.6,5.08 arc-90 9.14,5.54 9.14,13.31 arc-90 9.79,13.96 R13.2 arc90 12.41,12.45 24.02,12.45 arc90 26.05,14.48 | RPI1.1 arc90 11.19,48.41 30.68,48.41 | 30.68,48.41 38.46,48.41 arc-90 42.77,44.09 | 42.77,44.09 42.77,40.22 C15.1 arc90 42.06,39.5 U1.4 42.06,36.42 arc-90 41.3,35.66 | U1.6 40.46,36.51 arc90 41.3,35.66 | 26.05,4.87 C3.1 26.05,12.39 26.05,14.48 | 26.05,14.48 26.05,23.81 arc-90 28.8,26.57 36.42,26.57 39.12,26.57 | 39.12,26.57 39.17,26.57 arc90 39.66,27.06 U1.18 39.66,34.02 arc-90 41.3,35.66 | J1.VCC 8.94,29.36 arc90 10.46,30.89 10.46,31.45 arc-90 12.09,33.07 14.99,33.07 arc-90 16.46,31.6 J3.2 24.38,30.43 arc-90 26.06,28.75 26.06,23.82 | 52.89,13.27 arc90 53.85,14.22 53.85,18.59 arc-90 54.86,19.61 | 54.86,19.61 55.99,19.61 | C10.1 U6.5 | 54.86,19.61 53.65,19.61 arc-90 52.27,20.98 52.27,28.33 arc90 R5.2 R6.2 50.05,36.82 arc90 42.77,44.09 | RPI1.17 28.69,50.41 arc90 30.68,48.41 | 39.12,26.57 arc90 36.49,23.94 C7.1
WAKE  (via drill 0.38 pad 0.25)
  Top 0.254: U1.2 43.66,37.87 arc-90 44.55,38.76 v47.8,38.76 | U8.7 60.78,42.65 arc90 59.59,43.84 arc95 58.37,42.52 58.37,42.06 arc-90 57.1,40.79 v53.7,40.79
  Bottom 0.254: v47.8,38.76 51.66,38.76 arc90 v53.7,40.79

### Text on the board
Bottom: Designed by Akram Ali | bruh
tPlace: 5V | TX | RX | 3.3V | SDA | SCL | 5 | 26 | Status / LED | GND | v0.3 | piaq.io | MISO | 3.3V | SCK | MOSI | RESET | GND
sName: TX